# EAGLE design xduino.1.0 (EAGLE 6.5.0)
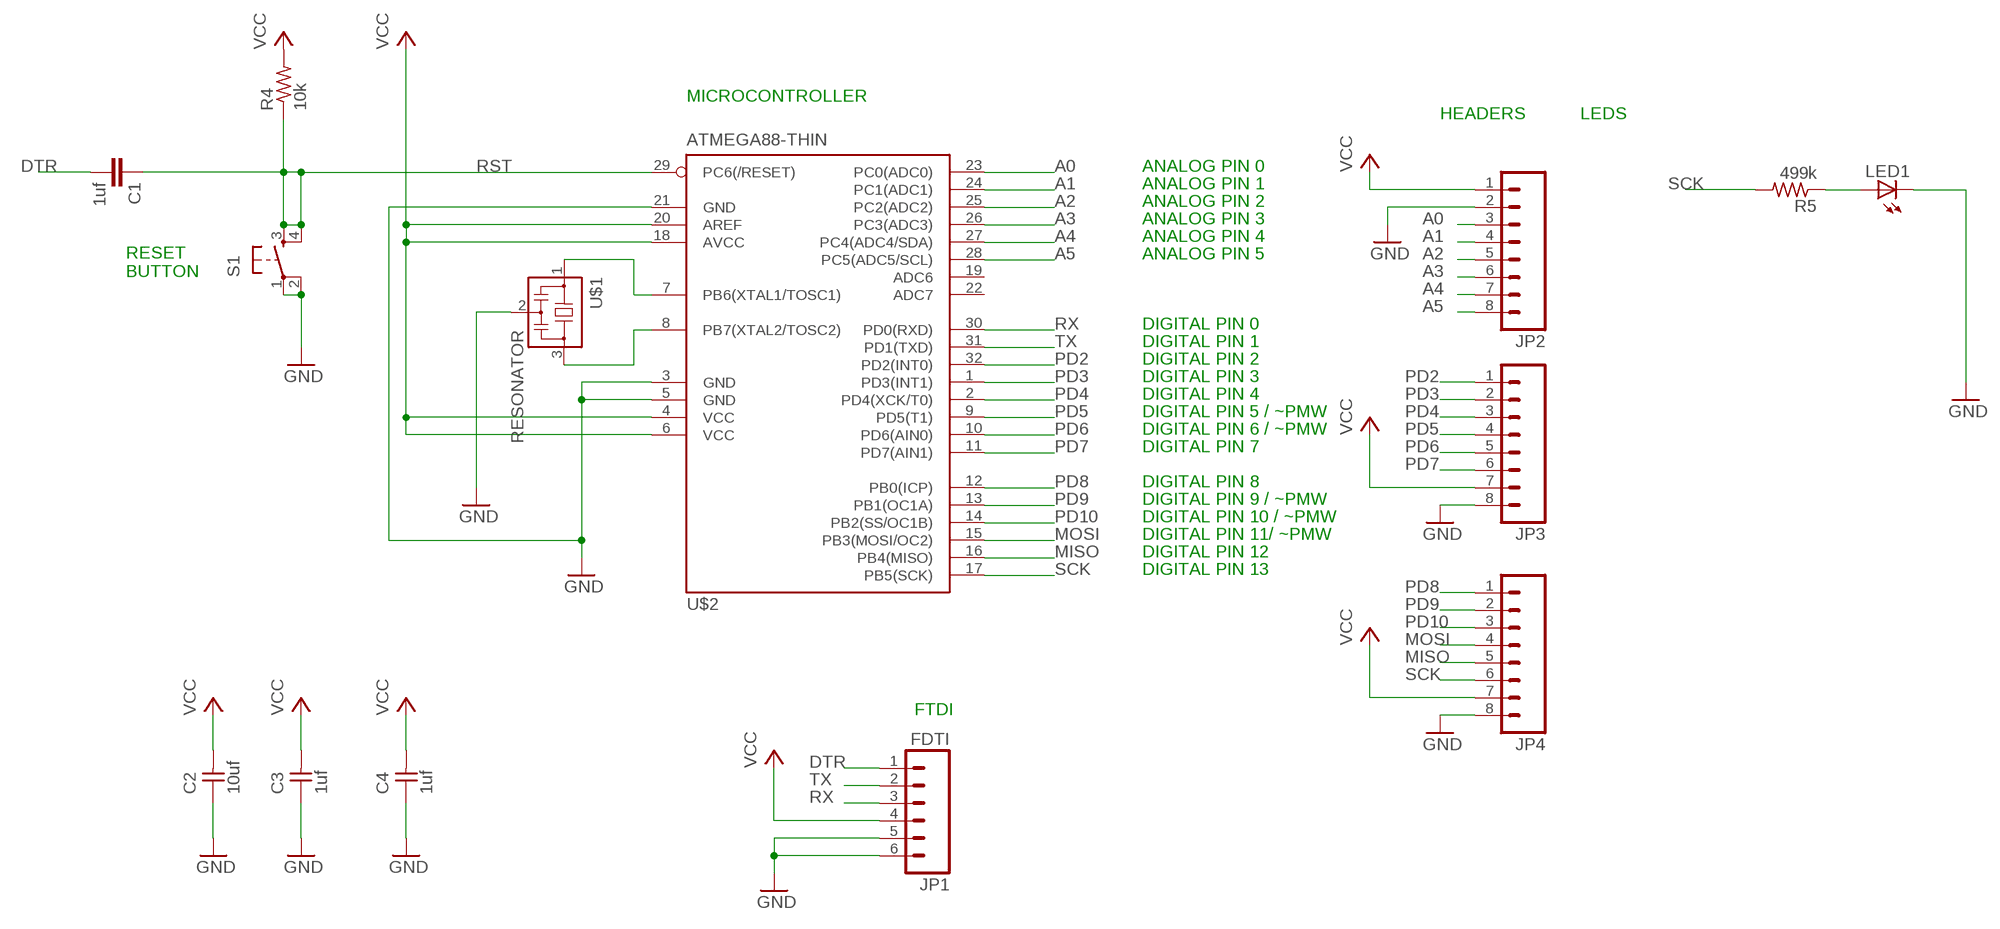
[diagram p0: schematic, sheet 1]

## Parts
C1  1uf  CAP1206  [1206]
C2  10uf  UNPOLARIZED_CAPACITOR1206  [1206]
C3  1uf  UNPOLARIZED_CAPACITOR1206  [1206]
C4  1uf  UNPOLARIZED_CAPACITOR1206  [1206]
JP1  FDTI  M061X06-SMD_EDGE_FEMALE  [1X06-SMD_EDGE]
JP2  M08  [1X08]
JP3  M08  [1X08]
JP4  M08  [1X08]
LED1  LED1206  [1206]
R4  10k  RESISTOR1206  [1206]
R5  499k  RESISTOR1206  [1206]
S1  6MM_SWITCH6MM_SWITCH  [6MM_SWITCH]
U$1  RESONATOR  [EFOBM]
U$2  ATMEGA88-THIN  [TQFP32-08THIN]

## Nets
A0: JP2.3 U$2.23(PC0(ADC0))
A1: JP2.4 U$2.24(PC1(ADC1))
A2: JP2.5 U$2.25(PC2(ADC2))
A3: JP2.6 U$2.26(PC3(ADC3))
A4: JP2.7 U$2.27(PC4(ADC4/SDA))
A5: JP2.8 U$2.28(PC5(ADC5/SCL))
DTR: C1.2 JP1.1
GND: C2.1 C3.1 C4.1 JP1.5 JP1.6 JP2.2 JP3.8 JP4.8 LED1.2(C) S1.1(P) S1.2(P1) U$1.2 U$2.3(GND) U$2.5(GND) U$2.21(GND)
MISO: JP4.5 U$2.16(PB4(MISO))
MOSI: JP4.4 U$2.15(PB3(MOSI/OC2))
N$2: LED1.1(A) R5.1
N$10: U$1.3 U$2.8(PB7(XTAL2/TOSC2))
N$11: U$1.1 U$2.7(PB6(XTAL1/TOSC1))
PD2: JP3.1 U$2.32(PD2(INT0))
PD3: JP3.2 U$2.1(PD3(INT1))
PD4: JP3.3 U$2.2(PD4(XCK/T0))
PD5: JP3.4 U$2.9(PD5(T1))
PD6: JP3.5 U$2.10(PD6(AIN0))
PD7: JP3.6 U$2.11(PD7(AIN1))
PD8: JP4.1 U$2.12(PB0(ICP))
PD9: JP4.2 U$2.13(PB1(OC1A))
PD10: JP4.3 U$2.14(PB2(SS/OC1B))
RST: C1.1 R4.1 S1.3(S) S1.4(S1) U$2.29(PC6(/RESET))
RX: JP1.3 U$2.30(PD0(RXD))
SCK: JP4.6 R5.2 U$2.17(PB5(SCK))
TX: JP1.2 U$2.31(PD1(TXD))
VCC: C2.2 C3.2 C4.2 JP1.4 JP2.1 JP3.7 JP4.7 R4.2 U$2.4(VCC) U$2.6(VCC) U$2.18(AVCC) U$2.20(AREF)
Unconnected: U$2.19(ADC6) U$2.22(ADC7)

## Notes on the sheet
- MICROCONTROLLER
- HEADERS | LEDS
- ANALOG PIN 0
- ANALOG PIN 1
- ANALOG PIN 2
- ANALOG PIN 3
- ANALOG PIN 4
- ANALOG PIN 5
- RESET 
  BUTTON
- DIGITAL PIN 0
- DIGITAL PIN 1
- DIGITAL PIN 2
- DIGITAL PIN 3
- DIGITAL PIN 4
- DIGITAL PIN 5 / ~PMW
- DIGITAL PIN 6 / ~PMW
- DIGITAL PIN 7
- DIGITAL PIN 8
- DIGITAL PIN 9 / ~PMW
- DIGITAL PIN 10 / ~PMW
- DIGITAL PIN 11/ ~PMW
- DIGITAL PIN 12
- DIGITAL PIN 13
- FTDI

## Library data of the parts
C1 = 01_SparkFun:CAP: Capacitor Standard 0603 ceramic capacitor, and 0.1" leaded capacitor.
C2-C4 = 01_FAB_Hello:UNPOLARIZED_CAPACITOR: unpolarized_capacitor
JP1 = 01_SparkFun:M06: Header 6 Standard 6-pin 0.1" header. Use with straight break away headers (SKU : PRT-00116), right angle break away headers (PRT-00553), swiss pins (PRT-00743), machine pins (PRT-00117), and female headers (PRT-00115). Molex polarized connector foot print use with SKU : PRT-08094 with associated crimp pins and housings. NOTES ON THE VARIANTS LOCK and LOCK_LONGPADS... This footprint was designed to help hold the alignment of a through-hole component (i.e. 6-pin header) while soldering it into place. You may notice that each hole has been shifted either up or down by 0.005 of an inch from it's more standard position (which is a perfectly straight line). This slight alteration caused the pins (the squares in the middle) to touch the edges of the holes. Because they are alternating, it causes a "brace" to hold the component in place. 0.005 has proven to be the perfect amount of "off-center" position when using our standard breakaway headers. Although looks a little odd when you look at the bare footprint, once you have a header in there, the alteration is very hard to notice. Also, if you push a header all the way into place, it is covered up entirely on the bottom side. This idea of altering the position of holes to aid alignment will be further integrated into the Sparkfun Library for other footprints. It can help hold any component with 3 or more connection pins.
JP2-JP4 = 01_SparkFun:M08: Header 8 Standard 8-pin 0.1" header. Use with straight break away headers (SKU : PRT-00116), right angle break away headers (PRT-00553), swiss pins (PRT-00743), machine pins (PRT-00117), and female headers (PRT-00115).
LED1 = 01_ng:LED
R4 = 01_FAB_Hello:RESISTOR
R5 = 01_ng:RESISTOR
S1 = 01_fab:6MM_SWITCH: OMRON SWITCH
U$1 = 01_fab:RESONATOR
U$2 = 01_fab:ATMEGA88-THIN

## Board
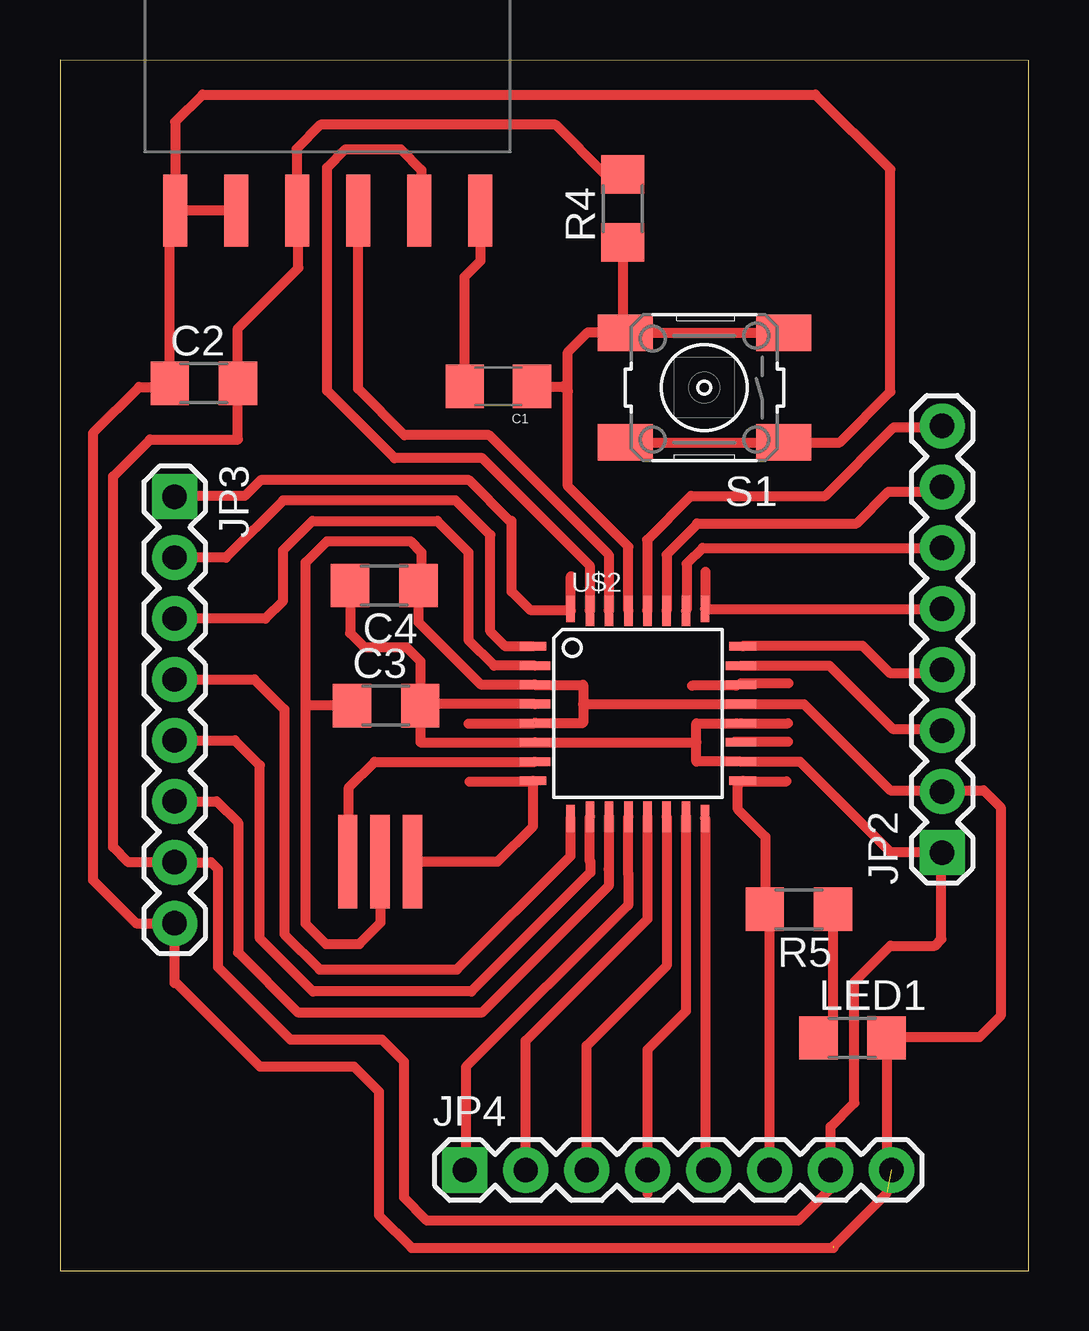
[diagram p1: board, top side]

Size 40.36 x 50.46 mm. Coordinates in mm from the lower left corner, seen from the top.
Outline: 0,0 40.36,0 40.36,50.43 0,50.46 0,0
Copper layers (1*16): Top 0.035mm / dielectric 1.5mm / Bottom 0.035mm
Design rules "default": minimum track width 10mil, minimum drill 24mil, track to track 8mil, track to pad 8mil, pad to pad 8mil, via to via 8mil, smd to smd 8mil, copper to edge 40mil, drill to drill 8mil, minimum pad ring 10mil, minimum via ring 8mil, stop-mask expansion 4mil, vias tented up to drill 0mil, thermal gap 10mil

### Footprints (pad centres in the part's own frame; a part is rotated, then mirrored left to right if it is on the bottom)
1206 = smd 1.6 x 1.8: 1 -1.4,0; 2 1.4,0
1206' = smd 1.6 x 1.803: 1 -1.422,0; 2 1.422,0
1X06-SMD_EDGE = smd 1 x 3: 1 0,-0.08; 2 2.54,-0.08; 3 5.08,-0.08; 4 7.62,-0.08; 5 10.16,-0.08; 6 12.7,-0.08
1X08 = drill 1.016 pad 1.88 square: 1 0,0 | drill 1.016 pad 1.88: 2 2.54,0; 3 5.08,0; 4 7.62,0; 5 10.16,0; 6 12.7,0; 7 15.24,0; 8 17.78,0
6MM_SWITCH = smd 2.286 x 1.524: 1 -3.302,2.286; 2 3.302,2.286; 3 -3.302,-2.286; 4 3.302,-2.286
EFOBM = smd 0.8 x 3.9: 1 -1.35,0; 2 0,0; 3 1.35,0
TQFP32-08THIN = smd 1.118 x 0.356: 1 -4.369,2.8; 8 -4.369,-2.8; 17 4.369,-2.8; 24 4.369,2.8 | smd 1.27 x 0.356: 2 -4.293,2; 3 -4.293,1.2; 4 -4.293,0.4; 5 -4.293,-0.4; 6 -4.293,-1.2; 7 -4.293,-2; 18 4.293,-2; 19 4.293,-1.2; 20 4.293,-0.4; 21 4.293,0.4; 22 4.293,1.2; 23 4.293,2 | smd 0.356 x 1.118: 9 -2.8,-4.369; 16 2.8,-4.369; 25 2.8,4.369; 32 -2.8,4.369 | smd 0.356 x 1.27: 10 -2,-4.293; 14 1.2,-4.293; 15 2,-4.293; 26 2,4.293; 27 1.2,4.293; 31 -2,4.293 | smd 0.35 x 1.27: 11 -1.2,-4.293; 12 -0.4,-4.293; 13 0.4,-4.293; 28 0.4,4.293; 29 -0.4,4.293; 30 -1.2,4.293

### Placement (x,y rotation side)
C1  18.26,36.86 180 top
C2  10uf  [1206']  5.99,36.98 0 top
C3  1uf  [1206']  13.59,23.55 0 top
C4  1uf  [1206']  13.51,28.55 180 top
JP1  17.5,44.09 180 top
JP2  36.75,17.42 90 top
JP3  4.78,32.26 270 top
JP4  16.87,4.19 0 top
LED1  [1206']  33.02,9.7 0 top
R4  10k  [1206']  23.44,44.27 90 top
R5  499k  [1206']  30.78,15.06 180 top
S1  26.85,36.8 180 top
U$1  13.33,17.04 0 top
U$2  24.08,23.22 0 top

### Tracks (layer width: path | path; a pad name or v marks a point on that pad's centre or on a via)
A0
  Top 0.406: JP2.3 36.68,22.58 34.7,22.58 32.06,25.22 U$2.23
A1
  Top 0.406: JP2.4 36.63,24.92 34.57,24.92 33.45,26.04 28.47,26.04 U$2.24
A2
  Top 0.406: 36.7,27.53 JP2.5 26.9,27.58 | U$2.25 26.9,27.58 | 26.9,27.58 26.9,29.13
A3
  Top 0.406: JP2.6 26.77,30.12 26.11,29.46 26.11,27.54 U$2.26
A4
  Top 0.406: JP2.7 36.55,32.46 34.52,32.46 33.2,31.14 26.54,31.14 26.54,31.11 25.27,29.84 U$2.27
A5
  Top 0.406: JP2.8 36.7,35.15 34.75,35.15 31.88,32.28 26.29,32.28 24.46,30.45 24.46,27.53 U$2.28
DTR
  Top 0.406: C1.2 16.86,41.42 17.53,42.09 17.53,44.15 JP1.1
GND  (3 unrouted)
  Top 0.406: 14.88,28.6 C4.1 | 12.12,23.49 C3.1 10.24,23.55 | C4.1 14.93,27.03 17.53,24.43 19.77,24.43 U$2.3 21.79,24.42 21.79,23.6 | U$1.2 13.36,17.02 13.36,14.5 12.47,13.61 11.07,13.61 10.24,14.45 10.24,23.55 | LED1.2 34.44,9.02 34.39,9.07 34.39,9.86 34.34,9.91 | 36.7,20.02 38.48,20.02 39.19,19.3 39.19,10.62 38.3,9.73 34.47,9.73 LED1.2 | 36.7,20.02 34.59,20.02 30.99,23.62 U$2.21 28.37,23.6 21.79,23.6 | 36.7,20.02 JP2.2 | S1.2 S1.1 32.49,34.52 34.59,36.63 34.59,45.9 31.47,49.02 5.94,49.02 4.8,47.88 JP1.6 | JP1.6 4.57,43.95 C2.1 4.42,36.83 3.3,36.83 1.37,34.9 1.37,16.28 3.18,14.48 JP3.8 4.78,11.99 4.85,11.99 8.33,8.51 12.24,8.51 13.28,7.47 13.28,2.31 14.66,0.94 32.23,0.94 | JP1.5 JP1.6 | 21.79,23.6 21.79,22.83 19.79,22.83 | LED1.2 34.44,3.23 32.23,1.02 | 10.24,23.55 10.24,29.51 11.13,30.4 14.61,30.4 15.06,29.95 15.06,28.68 C4.1
MISO
  Top 0.406: U$2.16 26.88,4.34 JP4.5
MOSI
  Top 0.406: 24.49,3.2 JP4.4 24.49,9.22 26.08,10.81 U$2.15
N$1
  Top 0.406: 28.37,24.49 30.35,24.49
N$2
  Top 0.406: R5.1 32.21,9.8 32.13,9.73 31.62,9.73 LED1.1
N$3
  Top 0.406: 28.17,24.38 26.34,24.38
N$5
  Top 0.406: 28.12,22.05 30.33,22.05
N$6
  Top 0.406: 19.79,20.37 17.07,20.37
N$7
  Top 0.406: 21.29,27.51 21.29,28.93
N$10
  Top 0.406: U$1.3 18.24,17.04 19.71,18.52 U$2.8
N$11
  Top 0.406: U$1.1 12.04,17.1 12.04,20.14 13.11,21.21 U$2.7
N$13
  Top 0.406: 19.71,22.78 17.02,22.78
N$14
  Top 0.406: 28.3,20.4 30.28,20.4
PD2
  Top 0.406: U$2.32 21.23,27.53 19.58,27.53 18.82,28.3 18.82,31.24 18.75,31.24 17.04,32.94 8.36,32.94 7.7,32.28 4.8,32.28 JP3.1 4.78,32.28
PD3
  Top 0.406: U$2.1 18.56,26.02 17.93,26.64 17.93,30.66 16.48,32.11 9.3,32.11 6.91,29.72 JP3.2
PD4
  Top 0.406: U$2.2 18.09,25.22 17.02,26.29 17.02,29.95 15.72,31.24 10.52,31.24 9.3,30.02 9.3,27.91 8.56,27.18 JP3.3
PD5
  Top 0.406: JP3.4 8.1,24.64 9.35,23.39 9.35,14.02 10.82,12.55 16.54,12.55 21.26,17.27 21.28,17.27 U$2.9
PD6
  Top 0.406: JP3.5 7.29,22.1 8.33,21.06 8.33,13.84 10.54,11.63 17.15,11.63 22.1,16.59 22.1,17.04 22.08,17.04 U$2.10
PD7
  Top 0.406: JP3.6 6.53,19.56 7.42,18.67 7.42,13.26 9.91,10.77 17.6,10.77 22.86,16.03 22.86,16.74 22.88,16.74 U$2.11
PD8
  Top 0.406: U$2.12 23.68,16.54 23.67,16.54 23.67,15.21 23.65,15.21 16.92,8.48 16.92,4.24 JP4.1
PD9
  Top 0.406: JP4.2 19.41,9.58 24.48,14.65 U$2.13
PD10
  Top 0.406: JP4.3 21.95,9.37 25.28,12.71 U$2.14
RST
  Top 0.406: S1.4 S1.3 | 23.5,39.14 S1.4 | R4.1 23.44,39.19 S1.4 | 21.16,36.65 21.16,32.69 23.68,30.17 U$2.29 | 21.16,36.65 21.16,38.28 22,39.12 23.52,39.12 S1.4 | C1.1 20.96,36.86 21.16,36.65
RX
  Top 0.406: JP1.3 12.42,36.75 14.35,34.82 17.88,34.82 22.86,29.84 22.86,27.53 U$2.30
SCK
  Top 0.406: R5.2 | R5.2 29.39,15.09 29.39,18.08 28.24,19.23 28.24,20.21 U$2.17 | JP4.6 29.57,14.86 R5.2
TX
  Top 0.406: JP1.2 15.06,44.28 15.06,45.87 14.2,46.74 11.89,46.74 11.13,45.97 11.13,36.68 13.94,33.86 17.6,33.86 22.07,29.39 U$2.31
VCC
  Top 0.406: C4.2 12.09,26.57 12.67,25.98 14.43,25.98 15.01,25.4 C3.2 | JP2.1 36.73,17.45 34.59,17.45 30.83,21.22 U$2.18 26.52,21.22 26.52,22.02 | 36.68,17.35 JP2.1 | JP2.1 36.73,17.4 36.73,13.82 36.45,13.54 34.59,13.54 33.1,12.04 33.1,6.98 32.11,5.99 JP4.7 32.11,3.43 30.76,2.08 15.29,2.08 14.33,3.05 14.33,8.71 13.41,9.63 9.6,9.63 6.58,12.65 6.58,16.74 6.3,17.02 JP3.7 2.84,17.02 2.21,17.65 2.21,33.1 3.73,34.62 arc-90 3.76,34.65 7.42,34.65 | 7.42,34.65 arc-90 7.42,34.65 | 7.42,34.65 C2.2 7.42,39.27 9.93,41.78 9.93,43.64 | 9.93,43.64 9.93,44.12 JP1.4 | R4.2 22.71,45.69 20.65,47.75 10.85,47.75 9.86,46.76 9.86,43.71 9.93,43.64 | 26.52,22.02 26.52,22.81 28.19,22.81 U$2.20 | U$2.20 | 26.52,22.02 U$2.6 15.01,22.02 C3.2 | U$2.4 15.08,23.62 C3.2 | U$2.20 30.33,22.81